# EAGLE schematic u (EAGLE 7.2.0)
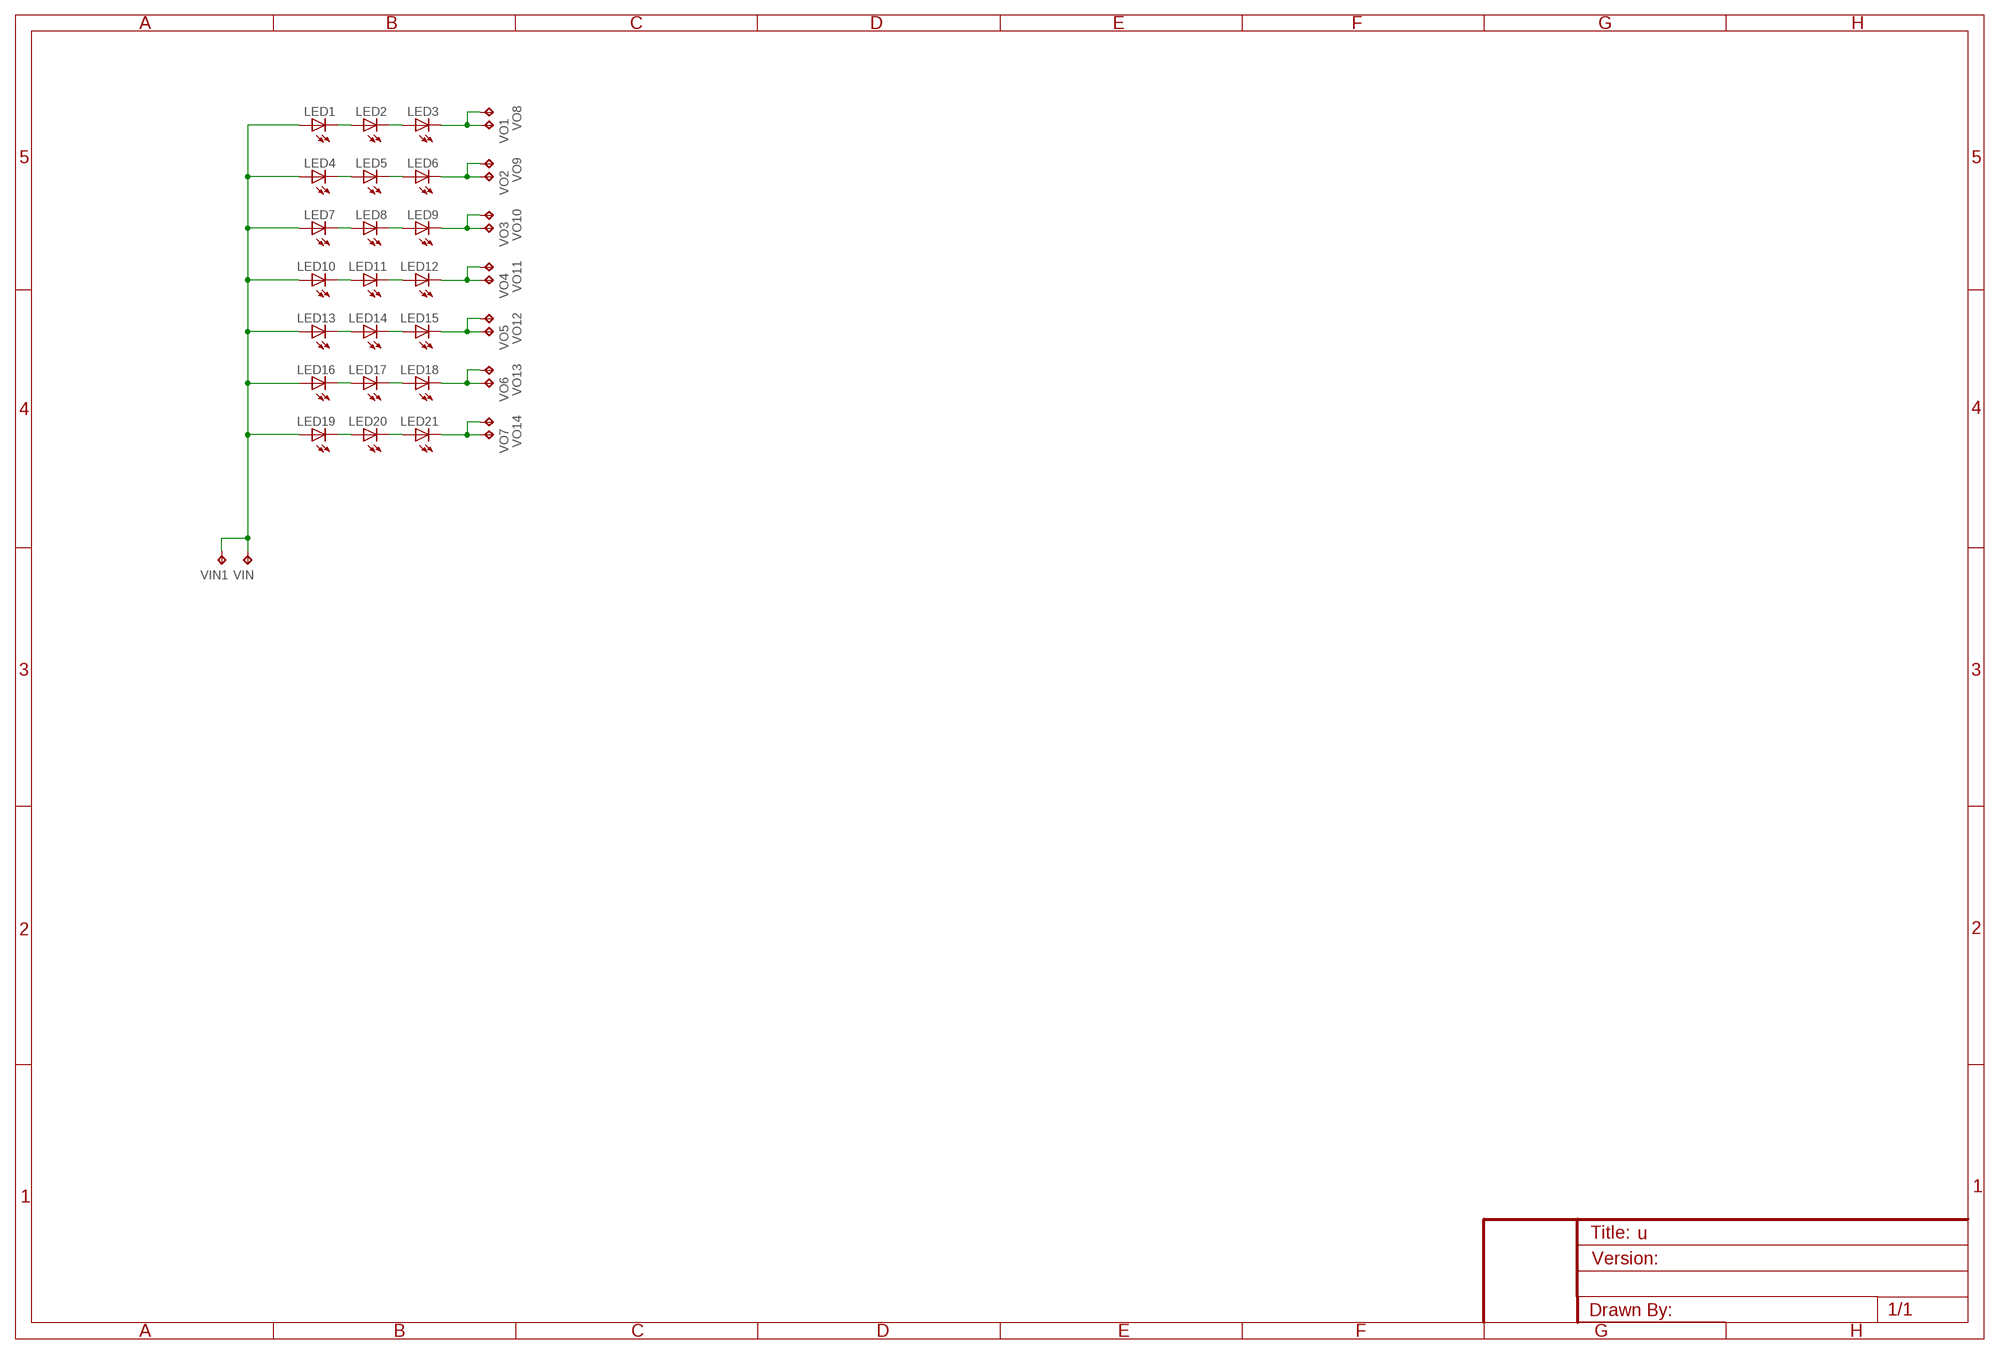
[diagram p0: schematic, sheet 1]

## Parts
LED1  LED0805  [LED_0805]
LED2  LED0805  [LED_0805]
LED3  LED0805  [LED_0805]
LED4  LED0805  [LED_0805]
LED5  LED0805  [LED_0805]
LED6  LED0805  [LED_0805]
LED7  LED0805  [LED_0805]
LED8  LED0805  [LED_0805]
LED9  LED0805  [LED_0805]
LED10  LED0805  [LED_0805]
LED11  LED0805  [LED_0805]
LED12  LED0805  [LED_0805]
LED13  LED0805  [LED_0805]
LED14  LED0805  [LED_0805]
LED15  LED0805  [LED_0805]
LED16  LED0805  [LED_0805]
LED17  LED0805  [LED_0805]
LED18  LED0805  [LED_0805]
LED19  LED0805  [LED_0805]
LED20  LED0805  [LED_0805]
LED21  LED0805  [LED_0805]
VIN  TEST_POINTPAD1-20  [P1-20]
VIN1  TEST_POINTPAD1-20  [P1-20]
VO1  TEST_POINTPAD1-20  [P1-20]
VO2  TEST_POINTPAD1-20  [P1-20]
VO3  TEST_POINTPAD1-20  [P1-20]
VO4  TEST_POINTPAD1-20  [P1-20]
VO5  TEST_POINTPAD1-20  [P1-20]
VO6  TEST_POINTPAD1-20  [P1-20]
VO7  TEST_POINTPAD1-20  [P1-20]
VO8  TEST_POINTPAD1-20  [P1-20]
VO9  TEST_POINTPAD1-20  [P1-20]
VO10  TEST_POINTPAD1-20  [P1-20]
VO11  TEST_POINTPAD1-20  [P1-20]
VO12  TEST_POINTPAD1-20  [P1-20]
VO13  TEST_POINTPAD1-20  [P1-20]
VO14  TEST_POINTPAD1-20  [P1-20]

## Nets
N$3: LED2.C LED3.A
N$4: LED1.C LED2.A
N$7: LED5.C LED6.A
N$8: LED4.C LED5.A
N$11: LED8.C LED9.A
N$12: LED7.C LED8.A
N$15: LED11.C LED12.A
N$16: LED10.C LED11.A
N$19: LED14.C LED15.A
N$20: LED13.C LED14.A
N$23: LED17.C LED18.A
N$24: LED16.C LED17.A
N$27: LED20.C LED21.A
N$28: LED19.C LED20.A
VIN: LED1.A LED4.A LED7.A LED10.A LED13.A LED16.A LED19.A VIN1.TP VIN.TP
VOUT1: LED3.C VO1.TP VO8.TP
VOUT2: LED6.C VO2.TP VO9.TP
VOUT3: LED9.C VO3.TP VO10.TP
VOUT4: LED12.C VO4.TP VO11.TP
VOUT5: LED15.C VO5.TP VO12.TP
VOUT6: LED18.C VO6.TP VO13.TP
VOUT7: LED21.C VO7.TP VO14.TP

## Library data of the parts
LED1-LED21 = CyberRailGuru:LED: LEDs Standard schematic elements and footprints for 5mm, 3mm, 1206, and 0603 sized LEDs. 5mm - Spark Fun Electronics SKU : COM-00529 (and others)
VIN VIN1 VO1-VO14 = CyberRailGuru:TEST_POINT: Test pad